# Altium schematic sheet FPGA - POWER.SchDoc
size A3; DocumentNumber: 7; SheetNumber: 8; SheetTotal: 19
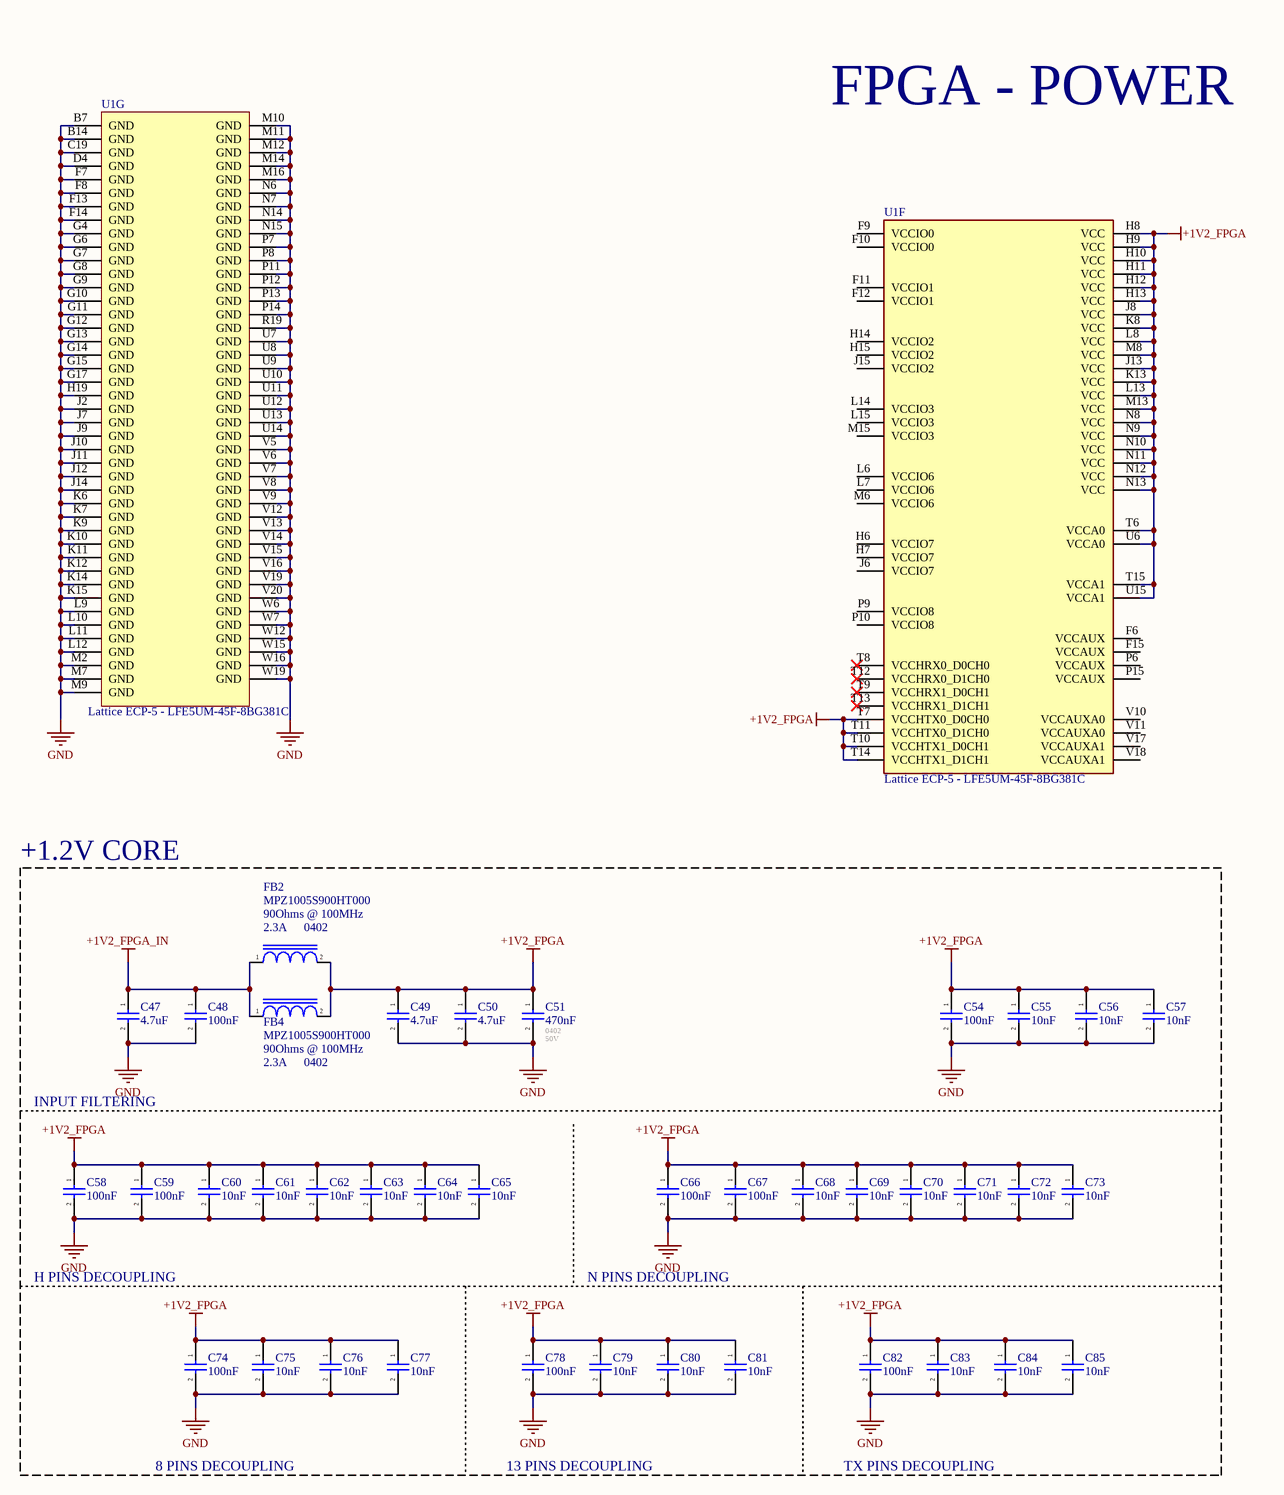
[diagram p0: FPGA - POWER.SchDoc]

## Parts
C47  4.7uF  [CAP_0805]
C48  100nF  [CAP_0402]
C49  4.7uF  [CAP_0805]
C50  4.7uF  [CAP_0805]
C51  470nF  Footprint: 0402  Voltage - Rated: 50V  [CAP_0402]
C54  100nF  [CAP_0402]
C55  10nF  [CAP_0201]
C56  10nF  [CAP_0201]
C57  10nF  [CAP_0201]
C58  100nF  [CAP_0402]
C59  100nF  [CAP_0402]
C60  10nF  [CAP_0201]
C61  10nF  [CAP_0201]
C62  10nF  [CAP_0201]
C63  10nF  [CAP_0201]
C64  10nF  [CAP_0201]
C65  10nF  [CAP_0201]
C66  100nF  [CAP_0402]
C67  100nF  [CAP_0402]
C68  10nF  [CAP_0201]
C69  10nF  [CAP_0201]
C70  10nF  [CAP_0201]
C71  10nF  [CAP_0201]
C72  10nF  [CAP_0201]
C73  10nF  [CAP_0201]
C74  100nF  [CAP_0402]
C75  10nF  [CAP_0201]
C76  10nF  [CAP_0201]
C77  10nF  [CAP_0201]
C78  100nF  [CAP_0402]
C79  10nF  [CAP_0201]
C80  10nF  [CAP_0201]
C81  10nF  [CAP_0201]
C82  100nF  [CAP_0402]
C83  10nF  [CAP_0201]
C84  10nF  [CAP_0201]
C85  10nF  [CAP_0201]
FB2  MPZ1005S900HT000  Impedance @ Freq: 90Ohms @ 100MHz  Package / Case: 0402  Current Rating: 2.3A  [IND_0402]
FB4  MPZ1005S900HT000  Impedance @ Freq: 90Ohms @ 100MHz  Package / Case: 0402  Current Rating: 2.3A  [IND_0402]
U1  Lattice ECP-5 - LFE5UM-45F-8BG381C  [CABGA-381]  (parts F,G of 7)

## Blocks framed on the sheet
+1.2V CORE: C47-C51 C54-C85 FB2 FB4

## Nets
+1V2_FPGA: C49.1 C50.1 C51.1 C54.1 C55.1 C56.1 C57.1 C58.1 C59.1 C60.1 C61.1 C62.1 C63.1 C64.1 C65.1 C66.1 C67.1 C68.1 C69.1 C70.1 C71.1 C72.1 C73.1 C74.1 C75.1 C76.1 C77.1 C78.1 C79.1 C80.1 C81.1 C82.1 C83.1 C84.1 C85.1 FB2.2 FB4.2 U1.H8(VCC) U1.H9(VCC) U1.H10(VCC) U1.H11(VCC) U1.H12(VCC) U1.H13(VCC) U1.J8(VCC) U1.J13(VCC) U1.K8(VCC) U1.K13(VCC) U1.L8(VCC) U1.L13(VCC) U1.M8(VCC) U1.M13(VCC) U1.N8(VCC) U1.N9(VCC) U1.N10(VCC) U1.N11(VCC) U1.N12(VCC) U1.N13(VCC) U1.T6(VCCA0) U1.T7(VCCHTX0_D0CH0) U1.T10(VCCHTX1_D0CH1) U1.T11(VCCHTX0_D1CH0) U1.T14(VCCHTX1_D1CH1) U1.T15(VCCA1) U1.U6(VCCA0) U1.U15(VCCA1)
+1V2_FPGA_IN: C47.1 C48.1 FB2.1 FB4.1
GND: C47.2 C48.2 C49.2 C50.2 C51.2 C54.2 C55.2 C56.2 C57.2 C58.2 C59.2 C60.2 C61.2 C62.2 C63.2 C64.2 C65.2 C66.2 C67.2 C68.2 C69.2 C70.2 C71.2 C72.2 C73.2 C74.2 C75.2 C76.2 C77.2 C78.2 C79.2 C80.2 C81.2 C82.2 C83.2 C84.2 C85.2 U1.B7(GND) U1.B14(GND) U1.C19(GND) U1.D4(GND) U1.F7(GND) U1.F8(GND) U1.F13(GND) U1.F14(GND) U1.G4(GND) U1.G6(GND) U1.G7(GND) U1.G8(GND) U1.G9(GND) U1.G10(GND) U1.G11(GND) U1.G12(GND) U1.G13(GND) U1.G14(GND) U1.G15(GND) U1.G17(GND) U1.H19(GND) U1.J2(GND) U1.J7(GND) U1.J9(GND) U1.J10(GND) U1.J11(GND) U1.J12(GND) U1.J14(GND) U1.K6(GND) U1.K7(GND) U1.K9(GND) U1.K10(GND) U1.K11(GND) U1.K12(GND) U1.K14(GND) U1.K15(GND) U1.L9(GND) U1.L10(GND) U1.L11(GND) U1.L12(GND) U1.M2(GND) U1.M7(GND) U1.M9(GND) U1.M10(GND) U1.M11(GND) U1.M12(GND) U1.M14(GND) U1.M16(GND) U1.N6(GND) U1.N7(GND) U1.N14(GND) U1.N15(GND) U1.P7(GND) U1.P8(GND) U1.P11(GND) U1.P12(GND) U1.P13(GND) U1.P14(GND) U1.R19(GND) U1.U7(GND) U1.U8(GND) U1.U9(GND) U1.U10(GND) U1.U11(GND) U1.U12(GND) U1.U13(GND) U1.U14(GND) U1.V5(GND) U1.V6(GND) U1.V7(GND) U1.V8(GND) U1.V9(GND) U1.V12(GND) U1.V13(GND) U1.V14(GND) U1.V15(GND) U1.V16(GND) U1.V19(GND) U1.V20(GND) U1.W6(GND) U1.W7(GND) U1.W12(GND) U1.W15(GND) U1.W16(GND) U1.W19(GND)

Not connected (* = marked no-connect by the designer): U1 F6(VCCAUX) F9(VCCIO0) F10(VCCIO0) F11(VCCIO1) F12(VCCIO1) F15(VCCAUX) H6(VCCIO7) H7(VCCIO7) H14(VCCIO2) H15(VCCIO2) J6(VCCIO7) J15(VCCIO2) L6(VCCIO6) L7(VCCIO6) L14(VCCIO3) L15(VCCIO3) M6(VCCIO6) M15(VCCIO3) P6(VCCAUX) P9(VCCIO8) P10(VCCIO8) P15(VCCAUX) T8(VCCHRX0_D0CH0)* T9(VCCHRX1_D0CH1)* T12(VCCHRX0_D1CH0)* T13(VCCHRX1_D1CH1)* V10(VCCAUXA0) V11(VCCAUXA0) V17(VCCAUXA1) V18(VCCAUXA1)

## Notes on the sheet
- FPGA - POWER
- INPUT FILTERING
- H PINS DECOUPLING
- N PINS DECOUPLING
- 8 PINS DECOUPLING
- 13 PINS DECOUPLING
- TX PINS DECOUPLING

## Library data of the parts
C47-C50 C54-C85 = CAP_CER: Generic SMT Ceramic Capacitor; Voltage - Rated: 25V; Operating Temperature: *; Tolerance: *; Mfr: *; ComponentLink1Description: Digikey; ComponentLink1URL: [Digikey Link]; Digikey Part No: *; ComponentLink2Description: Datasheet; ComponentLink2URL: [Datasheet Link]
  C47 C49 C50: Footprint: 0805
  C48 C54 C58 C59 C66 C67 C74 C78 C82: Footprint: 0402
  C55-C57 C60-C65 C68-C73 C75-C77 C79-C81 C83-C85: Footprint: 0201
C51 = CAP_CER: Generic SMT Ceramic Capacitor; Operating Temperature: *; Tolerance: *; Mfr: *; ComponentLink1Description: Digikey; ComponentLink1URL: [Digikey Link]; Digikey Part No: *; ComponentLink2Description: Datasheet; ComponentLink2URL: [Datasheet Link]
FB2 FB4 = IND_MPZ1005S900HT000: 90 Ohms @ 100 MHz 1 Power Line Ferrite Bead 0402 (1005 Metric) 2.3A 38mOhm; Resistance: 38mOhms; Operating Temperature: -55C - 125C; Rating: AEC-Q200
U1 = IC_LFE5UM-45F-8BG381C: IC FPGA 203 I/O 381CABGA; Mfr: Lattice Semiconductors; Supply Voltage: 1.045V - 1.115V; LABs/CLBs: 11000; Logic Elements: 44000; IOs: 203; RAM Bits: 1990656; Operating Temperature: 0C - 85C; Package / Case: 381-CABGA